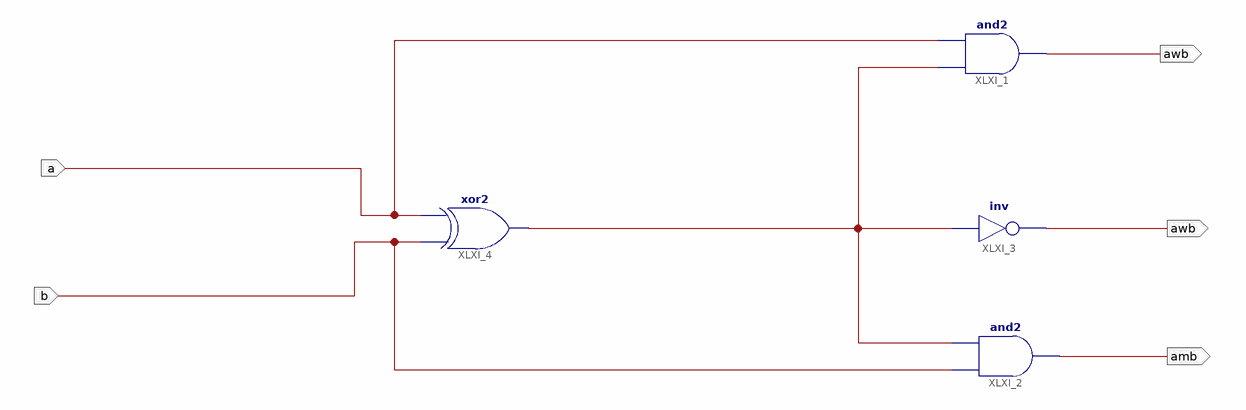
[diagram p0: schematic sheet 1]
// Xilinx ISE schematic divoc.sch (spartan3e) as structural Verilog: 4 symbols, 4 ports
module divoc (
  input  a,
  input  b,
  output awb,
  output amb
);

  wire XLXN_5;

  and XLXI_1 (awb, XLXN_5, a);
  and XLXI_2 (amb, b, XLXN_5);
  not XLXI_3 (awb, XLXN_5);
  xor XLXI_4 (XLXN_5, b, a);
endmodule
